# Altium schematic sheet LISC_TopLevel.SchDoc: LISC
size A4; Date: 2018-04-21; Author: EP; Organization: eptecon; Revision: A; SheetNumber: 1; SheetTotal: 5; PartNumber: 200511-000; DesignStatus: in progress; Project: LISC-XC95144XL; SheetTitle: Top; ProjectName: Project Name
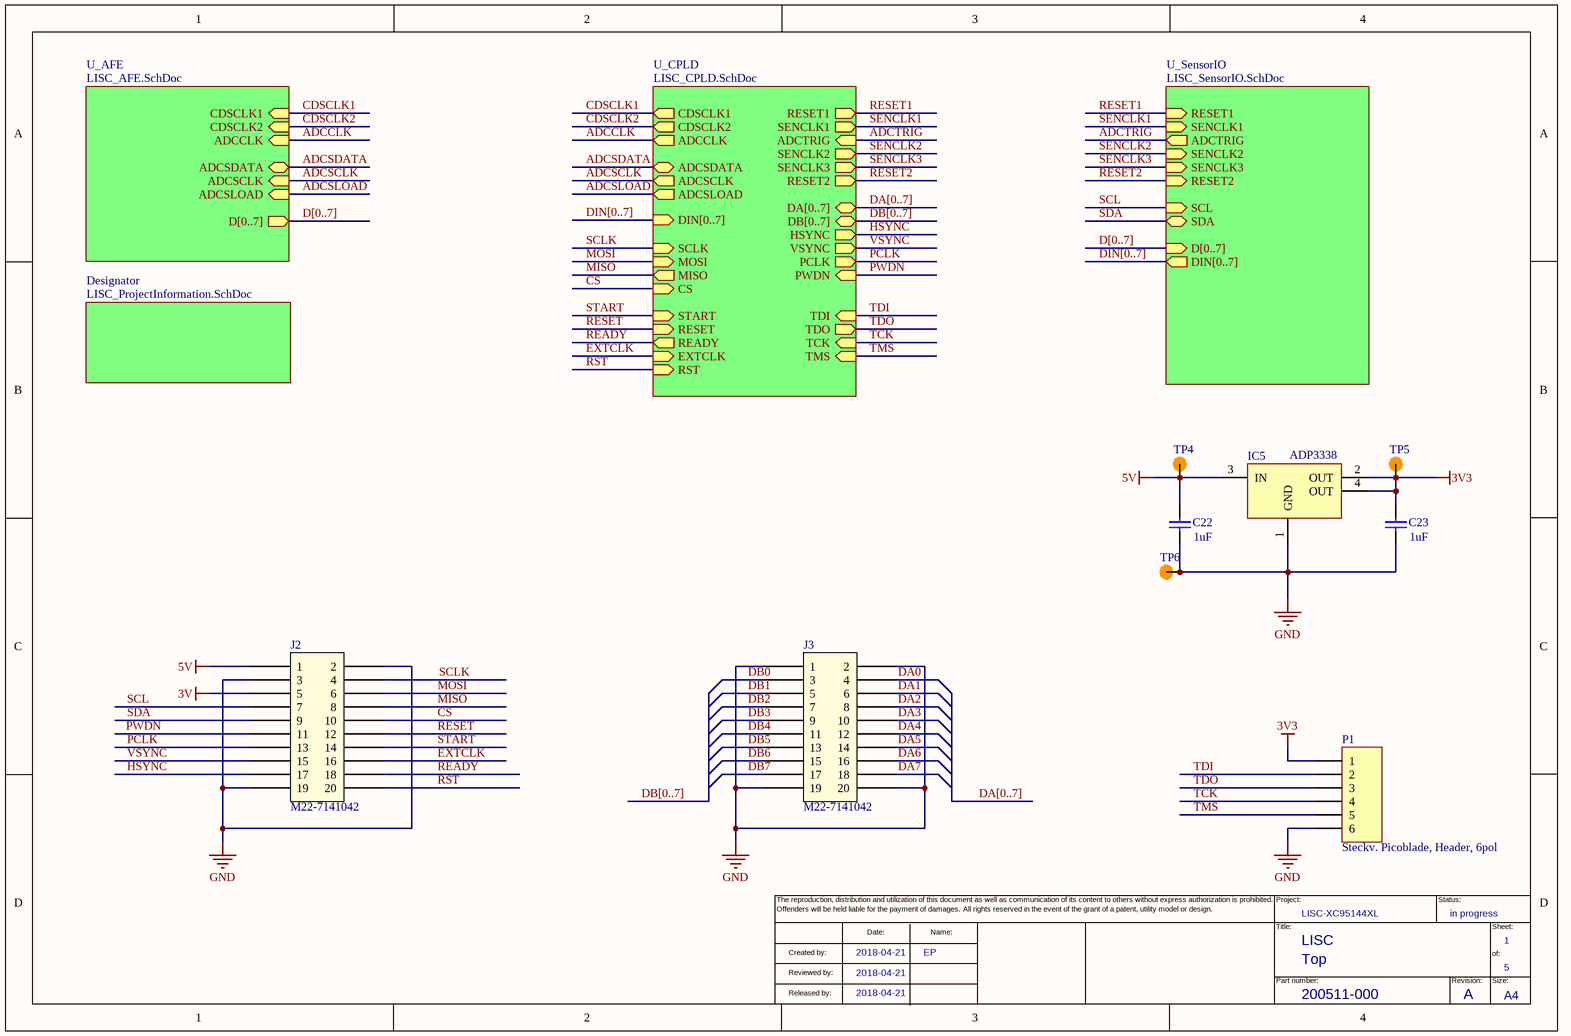
[diagram p0: LISC_TopLevel.SchDoc]

## Parts
C22  value 1uF  [1608[0603]]
C23  value 1uF  [1608[0603]]
IC5  ADP3338  [SOT223-4L]
J2  M22-7141042  [PCBComponent_1]
J3  M22-7141042  [PCBComponent_1]
P1  Steckv. Picoblade, Header, 6pol  [PicoBlade Header 6Pin gerade]
TP4  TP_SMD  [TP100_200_NS]  (value not drawn)
TP5  TP_SMD  [TP100_200_NS]  (value not drawn)
TP6  TP_SMD  [TP100_200_NS]  (value not drawn)

## Sub-sheets
Designator = LISC_ProjectInformation.SchDoc: no entries
U_AFE = LISC_AFE.SchDoc: CDSCLK1 (in), CDSCLK2 (in), ADCCLK (in), ADCSDATA (bidir), ADCSCLK (in), ADCSLOAD (in), D[0..7] (out)
U_CPLD = LISC_CPLD.SchDoc: RESET1 (out), SENCLK1 (out), SENCLK2 (out), SENCLK3 (out), RESET2 (out), ADCTRIG (in), CDSCLK1 (out), CDSCLK2 (out), ADCCLK (out), HSYNC (out), VSYNC (out), DA[0..7] (bidir), PCLK (out), PWDN (in), CS (in), MISO (out), MOSI (in), SCLK (in), READY (out), RESET (in), START (in), TDI (in), TDO (out), TCK (in), TMS (in), EXTCLK (in), ADCSDATA (bidir), ADCSCLK (out), ADCSLOAD (out), DIN[0..7] (in), DB[0..7] (bidir), RST (in)
U_SensorIO = LISC_SensorIO.SchDoc: RESET1 (in), SENCLK1 (in), SENCLK2 (in), SENCLK3 (in), RESET2 (in), ADCTRIG (out), SCL (in), SDA (bidir), D[0..7] (in), DIN[0..7] (out)

## Nets
3V: J2.5
3V3: C23.2 IC5.2(OUT) IC5.4(OUT) P1.1 TP5.1
5V: C22.2 IC5.3(IN) J2.1 TP4.1
GND: C22.1 C23.1 IC5.1(GND) J2.2 J2.3 J2.19 J3.1 J3.2 J3.19 J3.20 P1.6 TP6.1
ADCCLK: sheet U_AFE/ADCCLK, sheet U_CPLD/ADCCLK
ADCSCLK: sheet U_AFE/ADCSCLK, sheet U_CPLD/ADCSCLK
ADCSDATA: sheet U_AFE/ADCSDATA, sheet U_CPLD/ADCSDATA
ADCSLOAD: sheet U_AFE/ADCSLOAD, sheet U_CPLD/ADCSLOAD
ADCTRIG: sheet U_SensorIO/ADCTRIG, sheet U_CPLD/ADCTRIG
CDSCLK1: sheet U_AFE/CDSCLK1, sheet U_CPLD/CDSCLK1
CDSCLK2: sheet U_AFE/CDSCLK2, sheet U_CPLD/CDSCLK2
CS: J2.10 ; sheet U_CPLD/CS
DA0: J3.4
DA1: J3.6
DA2: J3.8
DA3: J3.10
DA4: J3.12
DA5: J3.14
DA6: J3.16
DA7: J3.18
DB0: J3.3
DB1: J3.5
DB2: J3.7
DB3: J3.9
DB4: J3.11
DB5: J3.13
DB6: J3.15
DB7: J3.17
EXTCLK: J2.16 ; sheet U_CPLD/EXTCLK
HSYNC: J2.17 ; sheet U_CPLD/HSYNC
MISO: J2.8 ; sheet U_CPLD/MISO
MOSI: J2.6 ; sheet U_CPLD/MOSI
PCLK: J2.13 ; sheet U_CPLD/PCLK
PWDN: J2.11 ; sheet U_CPLD/PWDN
READY: J2.18 ; sheet U_CPLD/READY
RESET: J2.12 ; sheet U_CPLD/RESET
RESET1: sheet U_SensorIO/RESET1, sheet U_CPLD/RESET1
RESET2: sheet U_SensorIO/RESET2, sheet U_CPLD/RESET2
RST: J2.20 ; sheet U_CPLD/RST
SCL: J2.7 ; sheet U_SensorIO/SCL
SCLK: J2.4 ; sheet U_CPLD/SCLK
SDA: J2.9 ; sheet U_SensorIO/SDA
SENCLK1: sheet U_SensorIO/SENCLK1, sheet U_CPLD/SENCLK1
SENCLK2: sheet U_SensorIO/SENCLK2, sheet U_CPLD/SENCLK2
SENCLK3: sheet U_SensorIO/SENCLK3, sheet U_CPLD/SENCLK3
START: J2.14 ; sheet U_CPLD/START
TCK: P1.4 ; sheet U_CPLD/TCK
TDI: P1.2 ; sheet U_CPLD/TDI
TDO: P1.3 ; sheet U_CPLD/TDO
TMS: P1.5 ; sheet U_CPLD/TMS
VSYNC: J2.15 ; sheet U_CPLD/VSYNC

## Buses and harness runs
bus D[0..7] = sheet U_AFE/D[0..7]
bus D[0..7] = sheet U_SensorIO/D[0..7]
bus DA[0..7]
bus DA[0..7] = sheet U_CPLD/DA[0..7]
bus DB[0..7]
bus DB[0..7] = sheet U_CPLD/DB[0..7]
bus DIN[0..7] = sheet U_CPLD/DIN[0..7]
bus DIN[0..7] = sheet U_SensorIO/DIN[0..7]

## Notes on the sheet
- The reproduction, distribution and utilization of this document as well as communication of its content to others without express authorization is prohibited.
- Offenders will be held liable for the payment of damages.
- All rights reserved in the event of the grant of a patent, utility model or design.
- Project:
- Status:
- Created by:
- Reviewed by:
- Date:
- Name:
- Title:
- Part number:
- Revision:
- Size:
- Sheet:
- of:
- Released by:
- A4

## Library data of the parts
C22 C23 = Cap Semi: Capacitor (Semiconductor SIM Model); Published: 8-Jun-2000; LatestRevisionDate: 29-May-2009; LatestRevisionNote: IPC-7351 Footprint Added.; PackageReference: C1206; Publisher: Altium Limited; PackageDescription: Chip Capacitor
IC5 = ADP3338: High Accuracy, Ultralow IQ, 1 A,  anyCAP® Low Dropout Regulator; Value: ADP3338; Supplier 1: Farnell; Supplier Part Number 1: 1651283
J2 J3 = M22-7141042: Harwig M22-7141042
P1 = 1.25mm Pitch PicoBlade™ Wire-to-Board Header, Vertical, with Friction Lock, 6 Circuits: MOLEX - 53047-0610 - STECKER,VERTIKAL,6KONT; Steckverbindertyp: Draht zu Platine; Kontaktanschluss: Durchsteckmontage, vertikal; Kontakte, Anzahl der: 6; Reihen, Anzahl der: 1; Raster: 1.25; Kontaktüberzug: Zinn; Kontaktmaterial: Phosphor-Bronze; Anschlussart: Lötmittel; Gehäusetyp: GF Nylon UL94V-0; Isolations-Widerstand: 100; Länge/Höhe, Außen-: 3.5; Min Betriebstemperatur: -40; Spannung, Betriebs-: 125; Spannung, Steh-: 250; Temperatur, Betriebs- max.: 85; Tiefe, Außen: 5.5; Supplier 1: Farnell; Manufacturer: MOLEX; Manufacturer Part Number: 53047-0610; RoHS: YES; Stock 1: 35787; Pricing 1: 5=0,673, 100=0,42, 250=0,358, 500=0,34, 1000=0,311 (EUR); Serie: PicoBlade; Gender: Header; Anschlusstyp: Draht zu Platine; Body Plating: Zinn; Nennstrom: 1; Pole, Anzahl der: 6; Raster, Anschluss: 1.25; Spannung, Nenn-, AC: 125; Wege, Anzahl der: 6; ComponentLink1URL: http://www.farnell.com/cad/694680.pdf; ComponentLink1Description: http://www.farnell.com/cad/694680.pdf; ComponentLink2URL: http://www.farnell.com/datasheets/524695.pdf; ComponentLink2Description: http://www.farnell.com/datasheets/524695.pdf; Supplier Part Number 1: 9733078